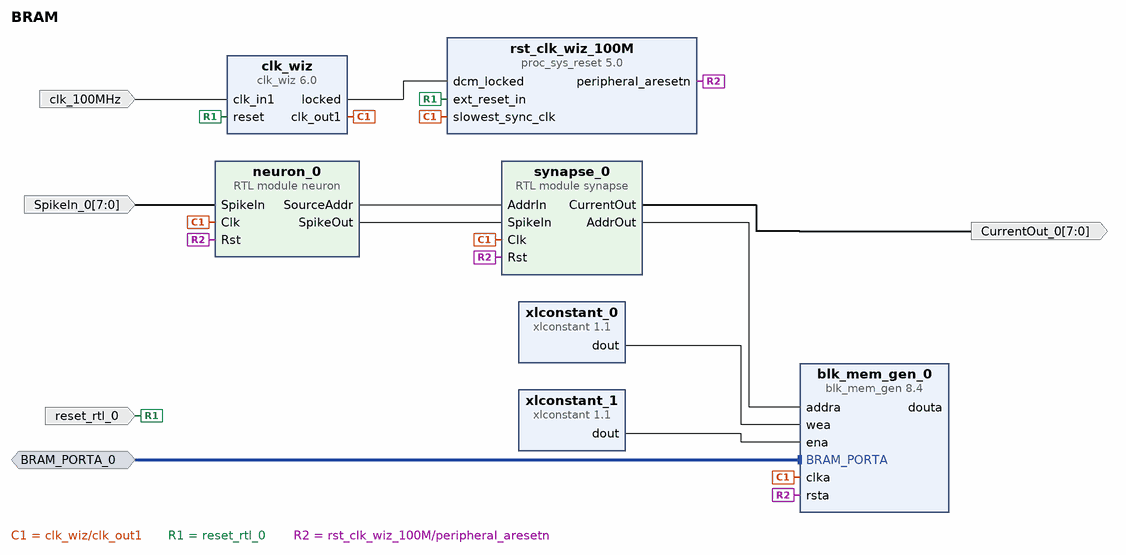
[diagram p0: block diagram of the top level]
# Vivado block design BRAM, xc7a100tcsg324-1, Vivado 2021.2.1
create_bd_design BRAM

create_bd_intf_port -mode Slave -vlnv xilinx.com:interface:bram_rtl:1.0 BRAM_PORTA_0
set_property -dict {CONFIG.MASTER_TYPE BRAM_CTRL} [get_bd_intf_ports BRAM_PORTA_0]
create_bd_port -dir I -type clk clk_100MHz
set_property -dict {CONFIG.FREQ_HZ 100000000} [get_bd_ports clk_100MHz]
create_bd_port -dir I -type rst reset_rtl_0
set_property -dict {CONFIG.POLARITY ACTIVE_HIGH} [get_bd_ports reset_rtl_0]
create_bd_port -dir I -from 7 -to 0 SpikeIn_0
create_bd_port -dir O -from 7 -to 0 CurrentOut_0

create_bd_cell -type ip -vlnv xilinx.com:ip:blk_mem_gen:8.4 blk_mem_gen_0
create_bd_cell -type ip -vlnv xilinx.com:ip:clk_wiz:6.0 clk_wiz
create_bd_cell -type ip -vlnv xilinx.com:ip:proc_sys_reset:5.0 rst_clk_wiz_100M
create_bd_cell -type ip -vlnv xilinx.com:ip:xlconstant:1.1 xlconstant_0
set_property -dict {CONFIG.CONST_VAL 0} [get_bd_cells xlconstant_0]
create_bd_cell -type ip -vlnv xilinx.com:ip:xlconstant:1.1 xlconstant_1
create_bd_cell -type module -reference neuron neuron_0
create_bd_cell -type module -reference synapse synapse_0

# ---- connections ----

connect_bd_intf_net -intf_net BRAM_PORTA_0_1 [get_bd_intf_ports BRAM_PORTA_0] [get_bd_intf_pins blk_mem_gen_0/BRAM_PORTA]
connect_bd_net [get_bd_pins clk_wiz/clk_out1] \
  [get_bd_pins blk_mem_gen_0/clka] [get_bd_pins rst_clk_wiz_100M/slowest_sync_clk] [get_bd_pins neuron_0/Clk] \
  [get_bd_pins synapse_0/Clk]
connect_bd_net -net SpikeIn_0_1 [get_bd_ports SpikeIn_0] [get_bd_pins neuron_0/SpikeIn]
# net blk_mem_gen_0_douta has one end: blk_mem_gen_0/douta
connect_bd_net [get_bd_ports clk_100MHz] [get_bd_pins clk_wiz/clk_in1]
connect_bd_net [get_bd_pins clk_wiz/locked] [get_bd_pins rst_clk_wiz_100M/dcm_locked]
connect_bd_net [get_bd_pins neuron_0/SourceAddr] [get_bd_pins synapse_0/AddrIn]
connect_bd_net [get_bd_pins neuron_0/SpikeOut] [get_bd_pins synapse_0/SpikeIn]
connect_bd_net -net reset_rtl_0_1 [get_bd_ports reset_rtl_0] [get_bd_pins clk_wiz/reset] [get_bd_pins rst_clk_wiz_100M/ext_reset_in]
connect_bd_net [get_bd_pins rst_clk_wiz_100M/peripheral_aresetn] \
  [get_bd_pins blk_mem_gen_0/rsta] [get_bd_pins neuron_0/Rst] [get_bd_pins synapse_0/Rst]
connect_bd_net [get_bd_pins synapse_0/AddrOut] [get_bd_pins blk_mem_gen_0/addra]
connect_bd_net [get_bd_pins synapse_0/CurrentOut] [get_bd_ports CurrentOut_0]
connect_bd_net [get_bd_pins xlconstant_0/dout] [get_bd_pins blk_mem_gen_0/wea]
connect_bd_net [get_bd_pins xlconstant_1/dout] [get_bd_pins blk_mem_gen_0/ena]

validate_bd_design
save_bd_design
